# EAGLE design MS5803-14BA_Breakout (EAGLE 6.5.0)
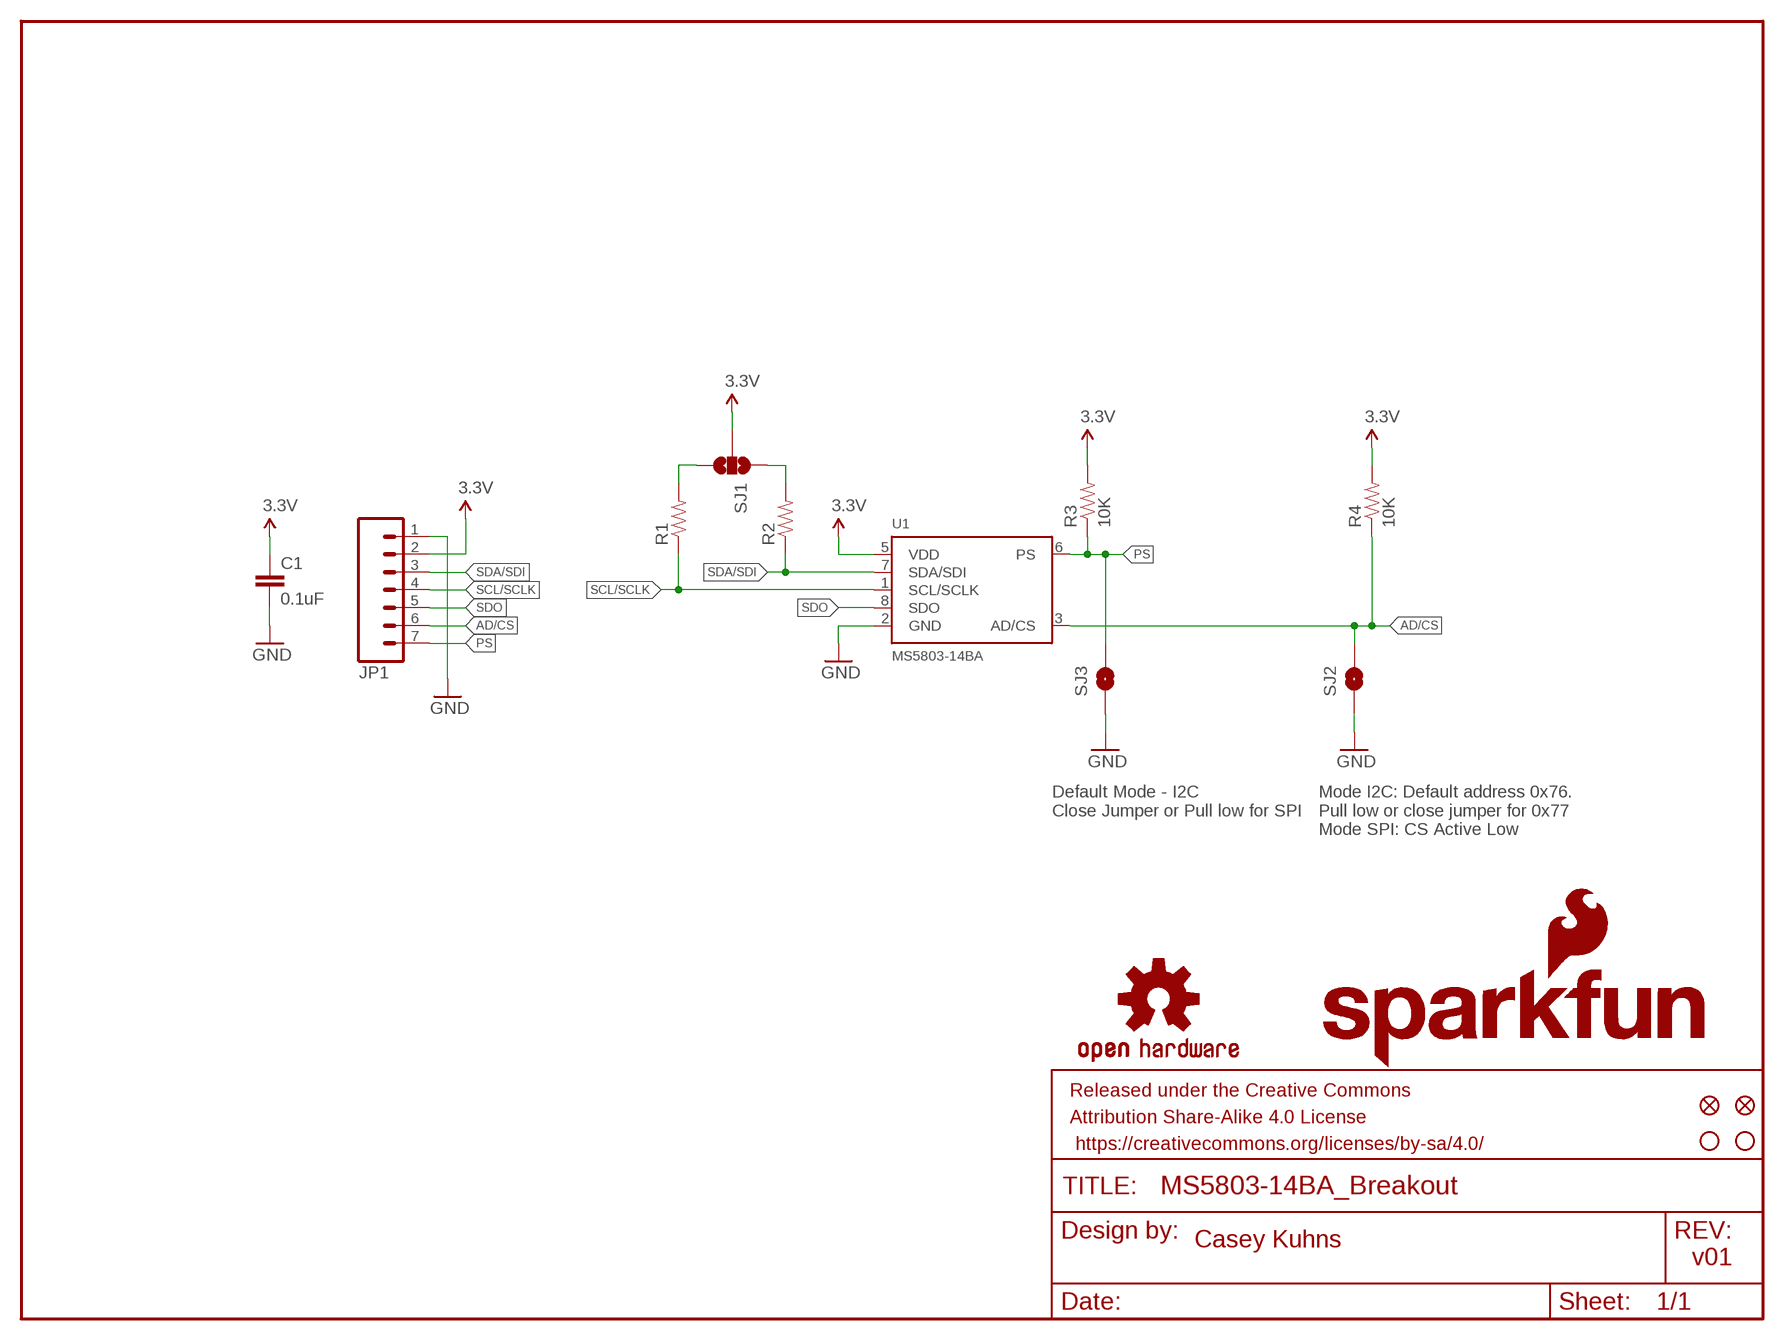
[diagram p0: schematic, sheet 1]

## Parts
C1  0.1uF  0.1UF-25V(+80/-20%)(0603)  [0603-CAP]
FID1  FIDUCIAL1X2  [FIDUCIAL-1X2]
FID2  FIDUCIAL1X2  [FIDUCIAL-1X2]
FRAME1  FRAME-LETTER  [CREATIVE_COMMONS]
JP1  M07  [1X07]
LOGO1  SFE_LOGO_FLAME.1_INCH  [SFE_LOGO_FLAME_.1]
LOGO2  SFE_LOGO_NAME_FLAME.1_INCH  [SFE_LOGO_NAME_FLAME_.1]
LOGO3  OSHW-LOGOS  [OSHW-LOGO-S]
R1  4.7KOHM1/10W1%(0603)  [0603]
R2  4.7KOHM1/10W1%(0603)  [0603]
R3  10K  10KOHM1/10W1%(0603)0603  [0603-RES]
R4  10K  10KOHM1/10W1%(0603)0603  [0603-RES]
SJ1  SOLDERJUMPER_2WAYPASTE1&2&3  [SJ_3_PASTE1&2&3]
SJ2  SOLDERJUMPERNO  [SJ_2S-NO]
SJ3  SOLDERJUMPERNO  [SJ_2S-NO]
STANDOFF1  STAND-OFFTIGHT  [STAND-OFF-TIGHT]
STANDOFF2  STAND-OFFTIGHT  [STAND-OFF-TIGHT]
U1  MS5803-14BA  [MS5803]

## Nets
3.3V: C1.1 JP1.2 R3.2 R4.2 SJ1.2 U1.5(VDD)
AD/CS: JP1.6 R4.1 SJ2.2 U1.3(AD/CS)
GND: C1.2 JP1.1 SJ2.1 SJ3.1 U1.2(GND)
N$1: R1.2 SJ1.3
N$2: R2.2 SJ1.1
PS: JP1.7 R3.1 SJ3.2 U1.6(PS)
SCL/SCLK: JP1.4 R1.1 U1.1(SCL/SCLK)
SDA/SDI: JP1.3 R2.1 U1.7(SDA/SDI)
SDO: JP1.5 U1.8(SDO)

## Notes on the sheet
- Default Mode - I2C
  Close Jumper or Pull low for SPI
- Mode I2C: Default address 0x76.
  Pull low or close jumper for 0x77
  Mode SPI: CS Active Low
- Casey Kuhns
- v01

## Library data of the parts
C1 = SparkFun-Capacitors:0.1UF-25V(+80/-20%)(0603): CAP-00810 Ceramic Standard decoupling cap; PROD_ID: CAP-00810
FID1 FID2 = SparkFun-Aesthetics:FIDUCIAL: Fiducial Alignment Points Various fiducial points for machine vision alignment.
FRAME1 = SparkFun-Aesthetics:FRAME-LETTER: Schematic Frame Standard 8.5x11 US Letter frame
JP1 = SparkFun-Connectors:M07: Header 7 Standard 7-pin 0.1" header. Use with straight break away headers (SKU : PRT-00116), right angle break away headers (PRT-00553), swiss pins (PRT-00743), machine pins (PRT-00117), and female headers (PRT-00115). NOTES ON THE VARIANTS LOCK and LOCK_LONGPADS... This footprint was designed to help hold the alignment of a through-hole component (i.e. 7-pin header) while soldering it into place. You may notice that each hole has been shifted either up or down by 0.005 of an inch from it's more standard position (which is usually a perfectly straight line). This slight alteration caused the pins (the squares in the middle) to touch the edges of the holes. Because they are alternating, it causes a "brace" to hold the header in place. 0.005 has proven to be the perfect amount of "off-center" position when using our standard breakaway headers. Although looks a little odd when you look at the bare footprint, once you have a header in there, the alteration is very hard to notice. Also, if you push a header all the way into place, it is covered up entirely on the bottom side. This idea of altering the position of holes to aid alignment will be further integrated into the Sparkfun Library for other footprints. It can help hold any component with 3 or more connection pins.
LOGO1 = SparkFun-Aesthetics:SFE_LOGO_FLAME: SFE Logo, flame only This is the SparkFun flame logo. The logo on the schematic will always be the same size; the package variant is the height of the flame. Default layer for the logo on the board is tSilk.
LOGO2 = SparkFun-Aesthetics:SFE_LOGO_NAME_FLAME: SFE Logo, name and flame This is the SparkFun full logo. The logo on the schematic will always be the same size; the package variant is the height of the flame part of the logo. Default layer for the logo on the board is tSilk.
LOGO3 = SparkFun-Aesthetics:OSHW-LOGO: Open Source Hardware Logo This logo indicates the piece of hardware it is found on incorporates a OSHW license and/or adheres to the definition of open source hardware found here: http://freedomdefined.org/OSHW
R1 R2 = SparkFun-Resistors:4.7KOHM1/10W1%(0603): RES-07857; PROD_ID: RES-07857
R3 R4 = SparkFun-Resistors:10KOHM1/10W1%(0603): RES-00824; PROD_ID: RES-00824
SJ1 = SparkFun-Passives:SOLDERJUMPER_2WAY: Solder Jumper 2 way solder jumper
SJ2 SJ3 = SparkFun-Passives:SOLDERJUMPER: Solder Jumper Standard SMD solder jumper. Used to automate production. Two varients : Normally Open and Normally Closed are the same, but have different paste layers. NC will have a large amount of paste and should jumper during reflow.
STANDOFF1 STANDOFF2 = SparkFun-Electromechanical:STAND-OFF: #4 Stand Off This is the mechanical footprint for a #4 phillips button head screw. Use the keepout ring to avoid running the screw head into surrounding components. SKU : PRT-00447
U1 = MS5803:MS5803-14BA

## Board
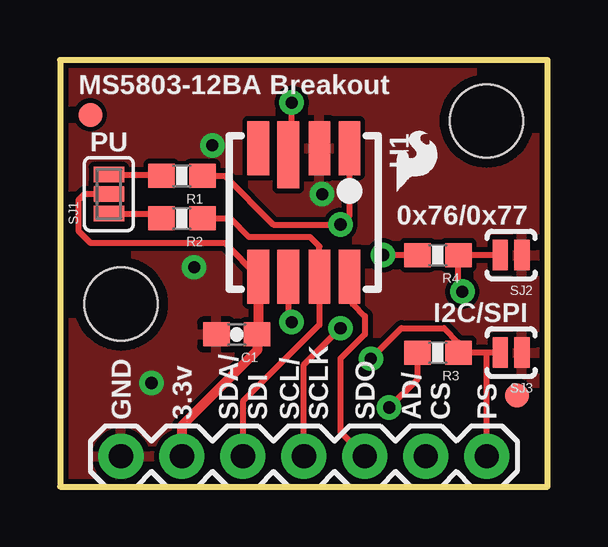
[diagram p1: board, top side]
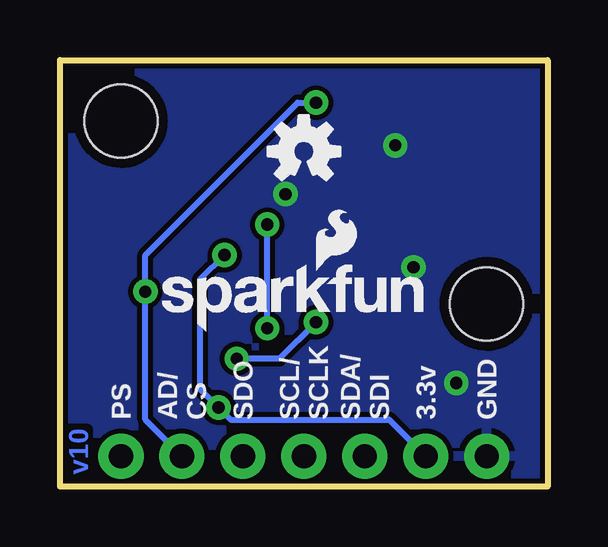
[diagram p2: board, bottom side, seen from below]

Size 20.32 x 17.78 mm. Coordinates in mm from the lower left corner, seen from the top.
Outline: 0,0 20.32,0 20.32,17.78 0,17.78 0,0
Copper layers (1*16): Top 0.035mm / dielectric 1.5mm / Bottom 0.035mm
Design rules "SparkFun-2-layer": minimum track width 7mil, minimum drill 15mil, track to track 8mil, track to pad 8mil, pad to pad 8mil, via to via 8mil, smd to smd 8mil, copper to edge 8mil, drill to drill 8mil, minimum pad ring 12mil, minimum via ring 10mil, stop-mask expansion 4mil, vias tented up to drill 20mil, thermal gap 10mil

### Footprints (pad centres in the part's own frame; a part is rotated, then mirrored left to right if it is on the bottom)
0603-CAP = smd 1.1 x 1: 1 -0.85,0; 2 0.85,0
FIDUCIAL-1X2 = smd 1 x 1: 1 0,0
1X07 = drill 1.016 pad 1.88: 1 0,0; 2 2.54,0; 3 5.08,0; 4 7.62,0; 5 10.16,0; 6 12.7,0; 7 15.24,0
0603-RES = smd 1.1 x 1: 1 -0.85,0; 2 0.85,0
PAD-JUMPER-3-NC_BY_PASTE_YES_SILK_FULL_BOX = smd 0.635 x 1.27: 1 -0.813,0; 2 0,0; 3 0.813,0
SJ_2S-NO = smd 0.635 x 1.27: 1 -0.45,0; 2 0.45,0
STAND-OFF-TIGHT = hole 3.048: 0,0
MS5803 = smd 2.25 x 0.9: 1 -2.675,1.9; 2 -2.675,0.65; 4 -2.675,-1.9; 5 2.675,-1.9; 6 2.675,-0.65; 7 2.675,0.65; 8 2.675,1.9 | smd 2.8 x 0.9: 3 -2.4,-0.65

### Placement (x,y rotation side)
C1  7.37,6.35 180 top
FID1  19.05,3.81 0 top
FID2  1.27,15.49 0 top
FRAME1  0,-8.89 0 top  (outside the outline)
JP1  2.54,1.27 0 top
LOGO1  13.72,11.94 0 top
LOGO2  16.51,6.35 0 bottom
LOGO3  10.16,13.97 0 bottom
R1  2.2k  [0603-RES]  5.08,12.95 180 top
R2  2.2k  [0603-RES]  5.08,11.18 180 top
R3  15.75,5.59 180 top
R4  15.75,9.65 180 top
SJ1  [PAD-JUMPER-3-NC_BY_PASTE_YES_SILK_FULL_BOX]  2.03,12.19 90 top
SJ2  18.8,9.65 180 top
SJ3  18.8,5.59 180 top
STANDOFF1  2.54,7.62 0 top
STANDOFF2  17.78,15.24 0 top
U1  10.16,11.43 270 top

### Tracks (layer width: path | path; a pad name or v marks a point on that pad's centre or on a via)
3.3V  (via drill 0.51)
  Top 0.254: SJ1.2 1.02,12.19 0.76,11.94 0.76,10.67 1.27,10.16 6.86,10.16 U1.5 | R4.2 v13.46,9.65 | 14.9,5.5 R3.2 14.9,4.48 v13.72,3.3
  Top 0.406: U1.5 8.26,6.39 C1.1 8.22,5.68 5.08,2.54 JP1.2
  Bottom 0.254: JP1.2 6.6,2.79 13.21,2.79 v13.72,3.3 14.48,4.06 14.48,8.64 v13.46,9.65
AD/CS  (via drill 0.51)
  Top 0.254: SJ2.2 R4.1 16.6,8.29 v16.76,8.13 | U1.3 9.65,13.97 v9.65,16
  Bottom 0.254: JP1.6 16.76,2.79 v16.76,8.13 16.76,9.65 10.41,16 v9.65,16
GND  (via drill 0.51)
  other vias: 3.81,4.32 10.92,12.19 5.59,9.14 6.35,14.22
  pour Top: 0,17.78 20.32,17.78 20.32,0 0,0
  pour Bottom: 0,17.78 20.32,17.78 20.32,0 0,0
N$1
  Top 0.254: SJ1.3 4.18,13.01 R1.2
N$2
  Top 0.254: SJ1.1 4.03,11.38 R2.2
PS  (via drill 0.51)
  Top 0.254: SJ3.2 17.78,5.59 | 17.78,5.59 R3.1 16.6,6.01 16,6.6 14.22,6.6 v12.95,5.33 | JP1.7 17.78,5.59 | U1.6 9.51,7 v9.65,6.86
  Bottom 0.254: v9.65,6.86 11.18,5.33 v12.95,5.33
SCL/SCLK  (via drill 0.51)
  Top 0.254: JP1.4 10.16,5.08 v11.68,6.6 | R1.1 6.86,12.95 8.89,10.92 v11.68,10.92 12.06,11.3 U1.1
  Bottom 0.254: v11.68,6.6 v11.68,10.92
SDA/SDI
  Top 0.254: JP1.3 7.62,3.56 10.81,6.75 U1.7 10.81,10.02 10.41,10.41 7.87,10.41 7.11,11.18 R2.1
SDO
  Top 0.254: U1.8 12.19,8.62 12.19,7.62 12.7,7.11 12.7,6.35 11.68,5.33 11.68,2.29 JP1.5

### Text on the board
Bottom: v10
tPlace: MS5803-12BA Breakout | PU | 0x76/0x77 | I2C/SPI | GND | 3.3v | SDA/ / SDI | SCL/ / SCLK | SDO | AD/ / CS | PS
bPlace: GND | 3.3v | SDA/ / SDI | SCL/ / SCLK | SDO | AD/ / CS | PS
tDocu: Casey Kuhns